# EasyEDA Pro project ProDoc_OHPP_005C_WITH_POWER.epro, board OHPP-005C
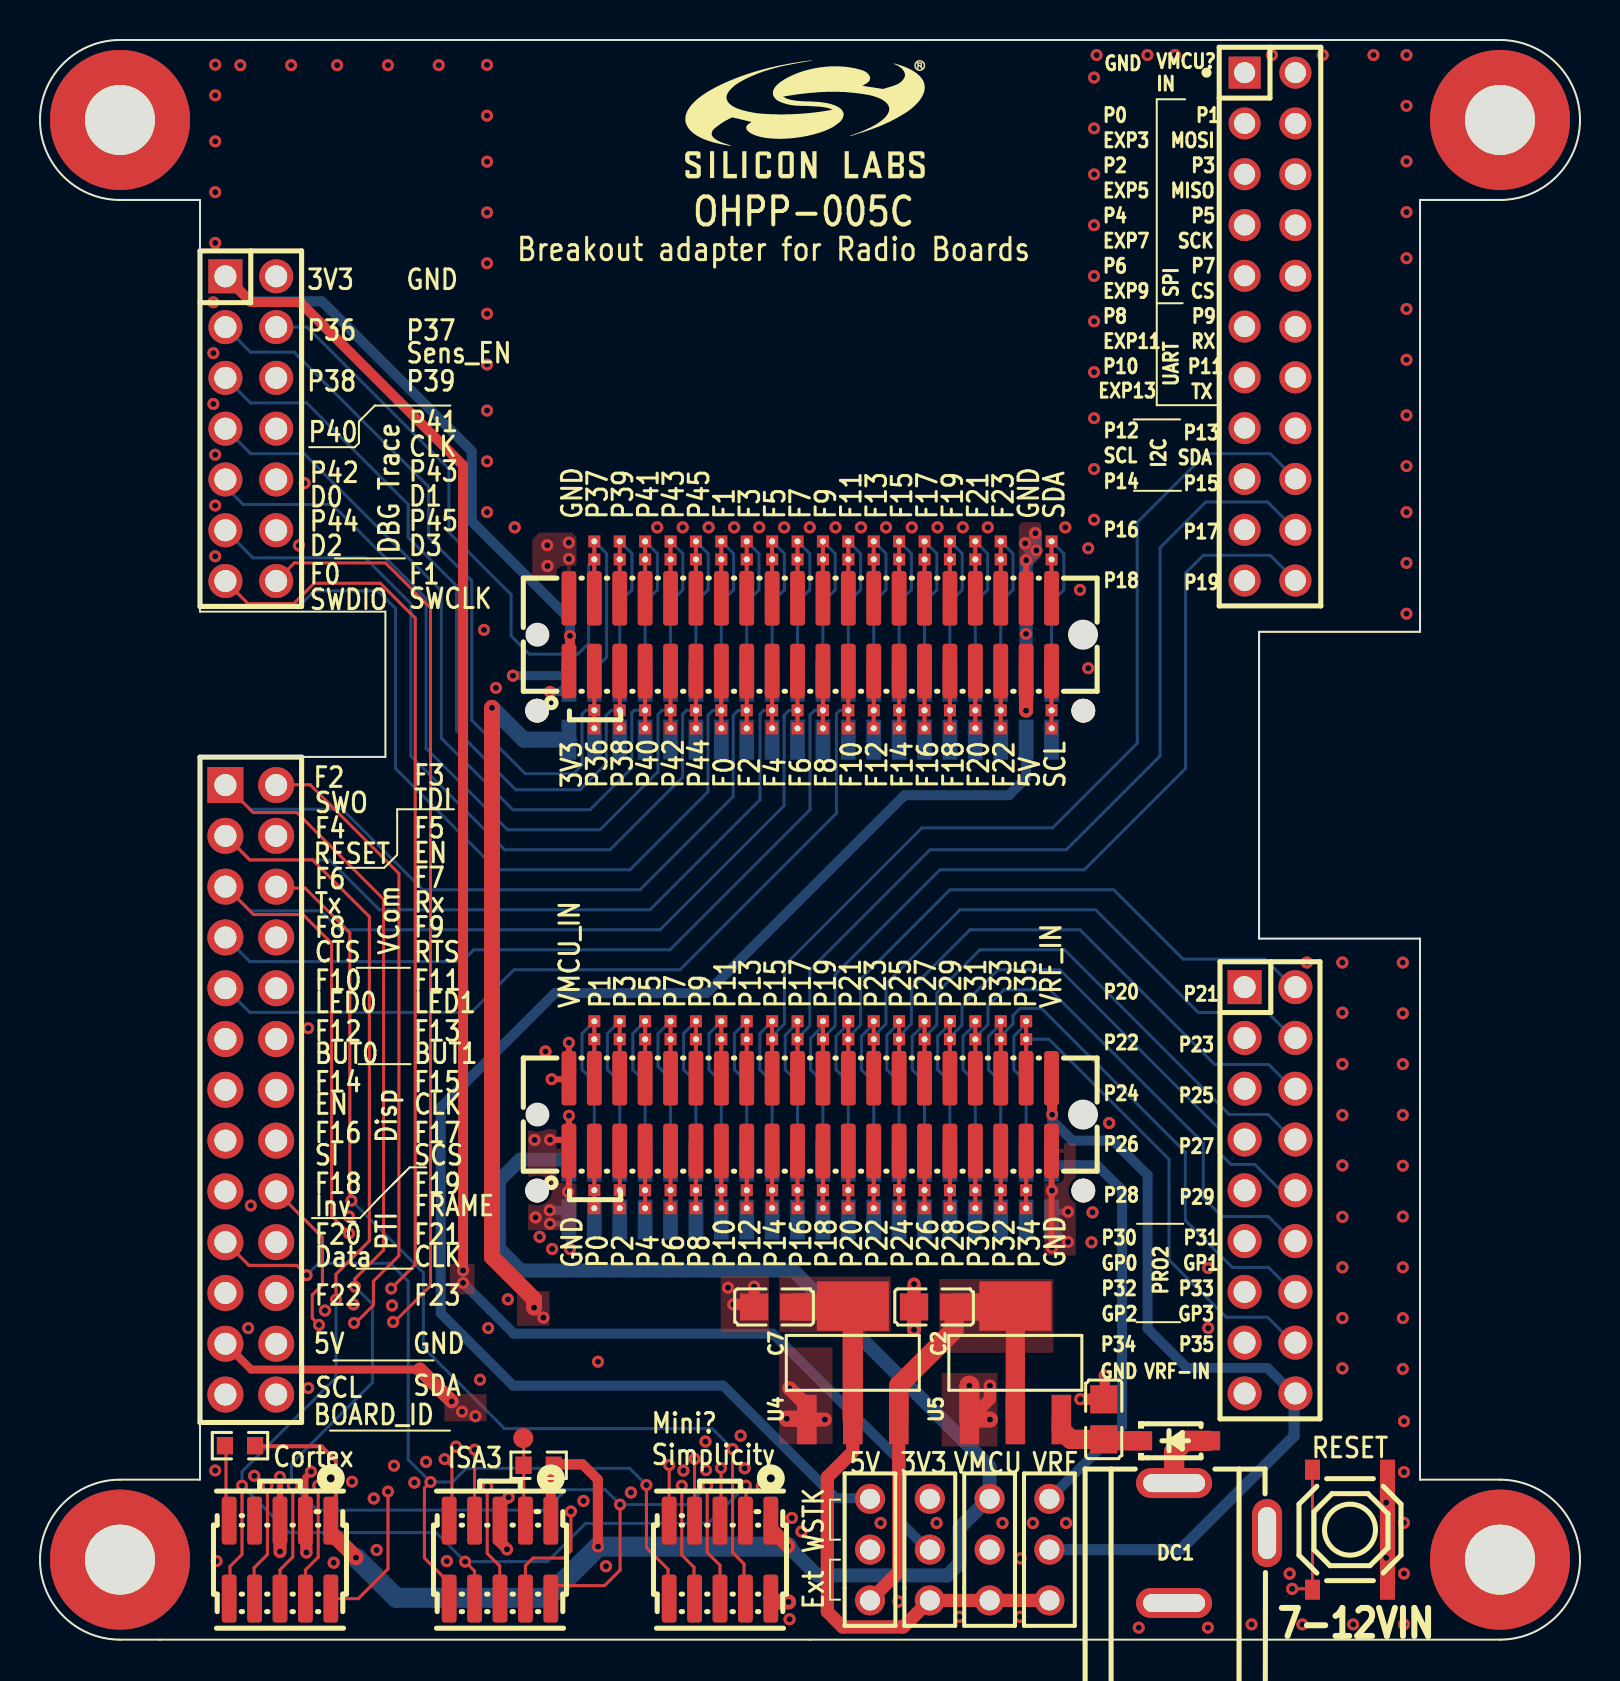
[diagram p3: board, top side]
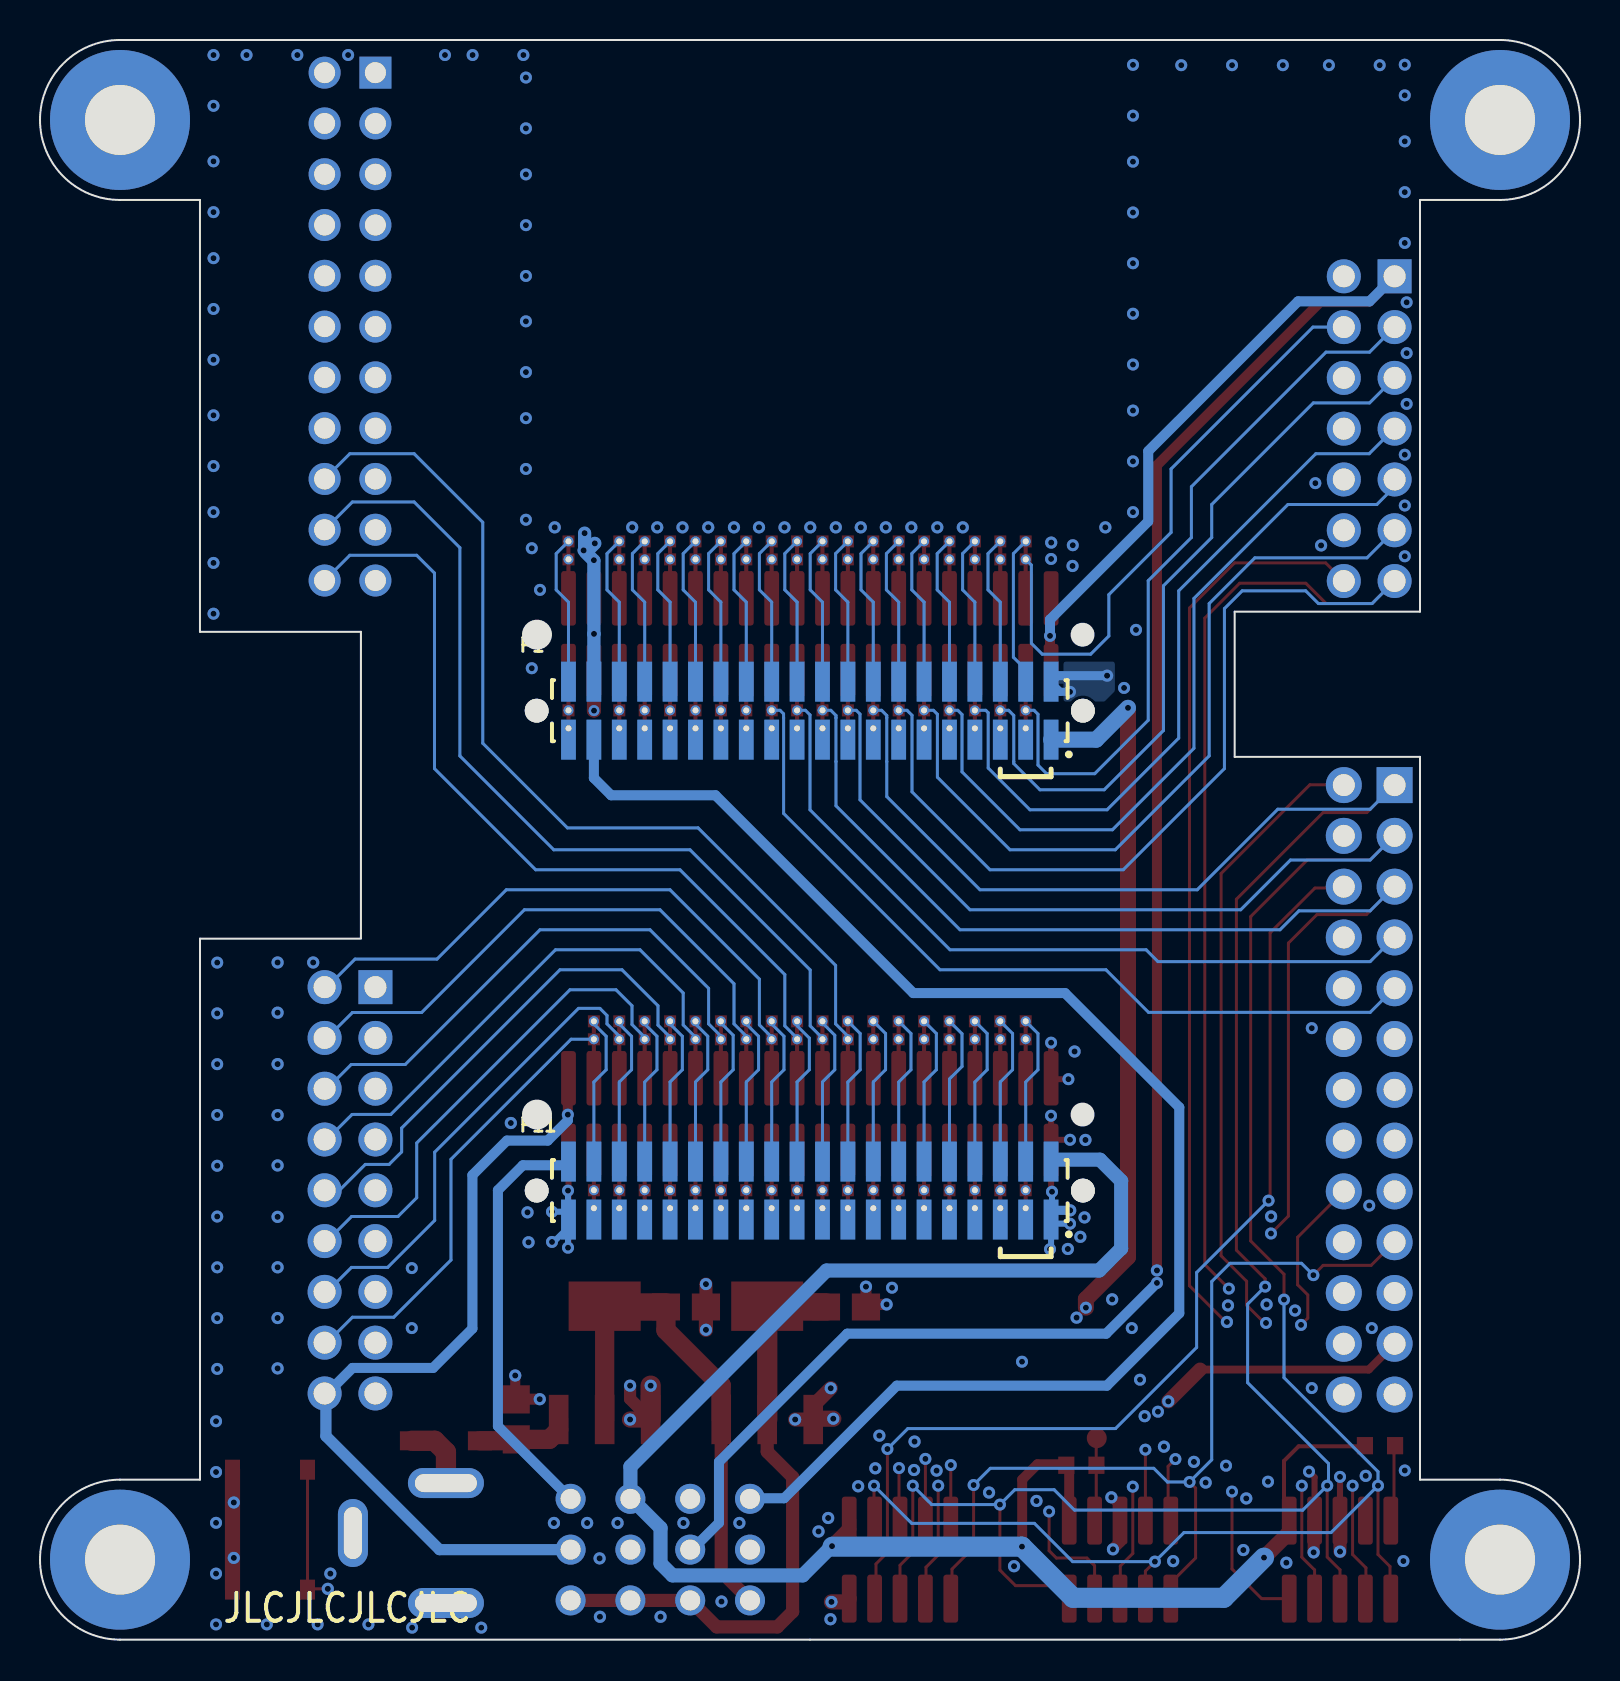
[diagram p4: board, bottom side, seen from below]

Outline 77 x 80 mm; copper layers: Top Layer, GND1, Inner1, Inner2, GND2, Bottom Layer. Coordinates in mm from the lower left corner of the outline.
Outline path: 4,72 arc(0,76) 4,80 73,80 arc(77,76) 73,72 69,72 69,50.4 60.96,50.4 60.96,35.06 69,35.06 69,8 73,8 arc(77,4) 73,0 4,0 arc(0,4) 4,8 8,8 8,44.15 17.27,44.15 17.27,51.41 8,51.41 8,72 4,72
Stack: Top Layer 0.035mm Outer layer thickness 1oz / Dielectric1 0.0994mm 3313 RC57% 4.2mil / GND1 0.0152mm Inner layer thickness / Dielectric2 0.55mm 0.55mm H/H No copper / Inner1 0.0152mm Inner layer thickness / Dielectric3 0.1088mm 2116 RC54% 4.9mil / Inner2 0.0152mm Inner layer thickness / Dielectric4 0.55mm 0.55mm H/H No copper / GND2 0.0152mm Inner layer thickness / Dielectric5 0.0994mm 3313 RC57% 4.2mil / Bottom Layer 0.035mm Outer layer thickness 1oz

## Design rules (mm)
template: Custom Config
spacing copperThickness1oz (default): track to track 0.152, other pairs 0 to 0.3
spacing copperThickness2oz: track to track 0.203, other pairs 0.152 to 0.3
spacing copperThicknessInner0.5oz: track to track 0.089, other pairs 0.152 to 0.3
track width copperThickness1oz (default): min 0.15, default 0.15, max 2.54
track width copperThickness2oz: min 0.203, default 0.254, max 2.54
track width copperThickness0.5oz: min 0.089, default 0.254, max 2.54
differential pair differentialPair (default): width min 0.127, default 0.254, max 2.54; gap min 0.152, default 0.152
via viaSize (default): diameter min 0.3, default 0.61, max 10; hole min 0.2, default 0.305, max 6.3

## Placement (name value [footprint] x y rotation side)
C2  10uF  [C0805]  44.7 16.64 0 top
C3  10uF  [C0805]  53.19 11.02 270 top
C7  10uF  [C0805]  36.7 16.64 0 top
D1  B5819W SL  [SOD-123_L2.7-W1.6-LS3.7-RD-1]  56.71 9.94 0 top
DC1  DC-005-20A  [DC-IN-TH_DC-005-20A]  59.03 4.83 90 top
H3  2.54-1*3  [HDR-TH_3P-P2.54-V-M-1]  47.48 4.5 90 top
H7  2.54-1*3  [HDR-TH_3P-P2.54-V-M-1]  50.47 4.5 90 top
H8  2.54-1*3  [HDR-TH_3P-P2.54-V-M-1]  44.49 4.5 90 top
H9  2.54-1*3  [HDR-TH_3P-P2.54-V-M-1]  41.5 4.5 90 top
H11  -  [HOLE_D3M5_D7M0_PAD_PTH]  4 4 0 top
H12  -  [HOLE_D3M5_D7M0_PAD_PTH]  73 4 0 top
H13  -  [HOLE_D3M5_D7M0_PAD_PTH]  4 76 0 top
H14  -  [HOLE_D3M5_D7M0_PAD_PTH]  73 76 0 top
H15  X6521WV-2x09H-C60D30  [HDR-TH_18P-P2.54-V-M-R2-C9-S2.54]  61.5 22.47 270 top
H16  X6521WV-2x11H-C60D30  [HDR-TH_22P-2.54-V-M-R2-C11-S2.54]  61.5 65.67 270 top
H17  X6521WV-2x13H-C60D30  [HDR-TH_26P-P2.54-V-M-R2-C13-S2.54]  10.54 27.5 270 top
H18  X6521WV-2x07H-C60D30  [HDR-TH_14P-P2.54-V-M-R2-C7-S2.54]  10.54 60.56 270 top
P1  *  [SAMTEC_SFC-120-T2-F-D-LC_1]  38.51 46.46 180 bottom
P3  3131-40MG0BK00T2  [CONN-SMD_40P-P1.27_WCON_3131-40MG0BK00T2_1]  38.51 50.26 180 top
P4  3131-40MG0BK00T2  [CONN-SMD_40P-P1.27_WCON_3131-40MG0BK00T2_1]  38.51 26.26 180 top
P5  -  [JUMPER_RECT_3PIN_NSNS]  27.72 22.47 90 top
P6  23bddce16d364f51bbc85156d37ba6bb  [IDC-SMD_3132-10MG0BK00R2_1]  34 4 180 top
P9  23bddce16d364f51bbc85156d37ba6bb  [IDC-SMD_3132-10MG0BK00R2_1]  12 4 180 top
P10  23bddce16d364f51bbc85156d37ba6bb  [IDC-SMD_3132-10MG0BK00R2_1]  23 4 180 top
P11  *  [SAMTEC_SFC-120-T2-F-D-LC_1]  38.51 22.46 180 bottom
P13  -  [JUMPER_RECT_3PIN_NSNS]  27.72 30.02 270 top
P14  -  [JUMPER_RECT_3PIN_NSNS]  28.99 22.47 90 top
P15  -  [JUMPER_RECT_3PIN_NSNS]  28.99 30.02 270 top
P16  -  [JUMPER_RECT_3PIN_NSNS]  30.26 22.47 90 top
P17  -  [JUMPER_RECT_3PIN_NSNS]  30.26 30.02 270 top
P18  -  [JUMPER_RECT_3PIN_NSNS]  31.53 22.47 90 top
P19  -  [JUMPER_RECT_3PIN_NSNS]  31.53 30.02 270 top
P20  -  [JUMPER_RECT_3PIN_NSNS]  32.8 22.47 90 top
P21  -  [JUMPER_RECT_3PIN_NSNS]  32.8 30.02 270 top
P22  -  [JUMPER_RECT_3PIN_NSNS]  34.07 22.47 90 top
P23  -  [JUMPER_RECT_3PIN_NSNS]  34.07 30.02 270 top
P24  -  [JUMPER_RECT_3PIN_NSNS]  35.34 22.47 90 top
P25  -  [JUMPER_RECT_3PIN_NSNS]  35.34 30.02 270 top
P26  -  [JUMPER_RECT_3PIN_NSNS]  36.61 22.47 90 top
P27  -  [JUMPER_RECT_3PIN_NSNS]  36.61 30.02 270 top
P28  -  [JUMPER_RECT_3PIN_NSNS]  37.88 22.47 90 top
P29  -  [JUMPER_RECT_3PIN_NSNS]  37.88 30.02 270 top
P30  -  [JUMPER_RECT_3PIN_NSNS]  39.15 22.47 90 top
P31  -  [JUMPER_RECT_3PIN_NSNS]  39.15 30.02 270 top
P32  -  [JUMPER_RECT_3PIN_NSNS]  40.42 22.47 90 top
P33  -  [JUMPER_RECT_3PIN_NSNS]  40.42 30.02 270 top
P34  -  [JUMPER_RECT_3PIN_NSNS]  41.69 22.47 90 top
P35  -  [JUMPER_RECT_3PIN_NSNS]  41.69 30.02 270 top
P36  -  [JUMPER_RECT_3PIN_NSNS]  42.96 22.47 90 top
P37  -  [JUMPER_RECT_3PIN_NSNS]  42.96 30.02 270 top
P38  -  [JUMPER_RECT_3PIN_NSNS]  44.23 22.47 90 top
P39  -  [JUMPER_RECT_3PIN_NSNS]  44.23 30.02 270 top
P40  -  [JUMPER_RECT_3PIN_NSNS]  45.5 22.47 90 top
P41  -  [JUMPER_RECT_3PIN_NSNS]  45.5 30.02 270 top
P42  -  [JUMPER_RECT_3PIN_NSNS]  46.77 22.47 90 top
P43  -  [JUMPER_RECT_3PIN_NSNS]  46.77 30.02 270 top
P44  -  [JUMPER_RECT_3PIN_NSNS]  48.04 22.47 90 top
P45  -  [JUMPER_RECT_3PIN_NSNS]  48.04 30.02 270 top
P46  -  [JUMPER_RECT_3PIN_NSNS]  49.31 22.47 90 top
P47  -  [JUMPER_RECT_3PIN_NSNS]  49.31 30.02 270 top
P48  -  [JUMPER_RECT_3PIN_NSNS]  27.72 46.47 90 top
P49  -  [JUMPER_RECT_3PIN_NSNS]  27.72 54.02 270 top
P50  -  [JUMPER_RECT_3PIN_NSNS]  28.99 46.47 90 top
P51  -  [JUMPER_RECT_3PIN_NSNS]  28.99 54.02 270 top
P52  -  [JUMPER_RECT_3PIN_NSNS]  30.26 46.47 90 top
P53  -  [JUMPER_RECT_3PIN_NSNS]  30.26 54.02 270 top
P54  -  [JUMPER_RECT_3PIN_NSNS]  31.53 46.47 90 top
P55  -  [JUMPER_RECT_3PIN_NSNS]  31.53 54.02 270 top
P56  -  [JUMPER_RECT_3PIN_NSNS]  32.8 46.47 90 top
P57  -  [JUMPER_RECT_3PIN_NSNS]  32.8 54.02 270 top
P58  -  [JUMPER_RECT_3PIN_NSNS]  34.07 46.47 90 top
P59  -  [JUMPER_RECT_3PIN_NSNS]  34.07 54.02 270 top
P60  -  [JUMPER_RECT_3PIN_NSNS]  35.34 46.47 90 top
P61  -  [JUMPER_RECT_3PIN_NSNS]  35.34 54.02 270 top
P62  -  [JUMPER_RECT_3PIN_NSNS]  36.61 46.47 90 top
P63  -  [JUMPER_RECT_3PIN_NSNS]  37.88 54.02 270 top
P64  -  [JUMPER_RECT_3PIN_NSNS]  36.61 54.02 270 top
P65  -  [JUMPER_RECT_3PIN_NSNS]  37.88 46.47 90 top
P66  -  [JUMPER_RECT_3PIN_NSNS]  39.15 46.47 90 top
P67  -  [JUMPER_RECT_3PIN_NSNS]  39.15 54.02 270 top
P68  -  [JUMPER_RECT_3PIN_NSNS]  40.42 46.47 90 top
P69  -  [JUMPER_RECT_3PIN_NSNS]  40.42 54.02 270 top
P70  -  [JUMPER_RECT_3PIN_NSNS]  41.69 46.47 90 top
P71  -  [JUMPER_RECT_3PIN_NSNS]  41.69 54.02 270 top
P72  -  [JUMPER_RECT_3PIN_NSNS]  42.96 46.47 90 top
P73  -  [JUMPER_RECT_3PIN_NSNS]  42.96 54.02 270 top
P74  -  [JUMPER_RECT_3PIN_NSNS]  44.23 46.47 90 top
P75  -  [JUMPER_RECT_3PIN_NSNS]  44.23 54.02 270 top
P76  -  [JUMPER_RECT_3PIN_NSNS]  45.5 46.47 90 top
P77  -  [JUMPER_RECT_3PIN_NSNS]  45.5 54.02 270 top
P78  -  [JUMPER_RECT_3PIN_NSNS]  46.77 46.47 90 top
P79  -  [JUMPER_RECT_3PIN_NSNS]  46.77 54.02 270 top
P80  -  [JUMPER_RECT_3PIN_NSNS]  48.04 46.47 90 top
P81  -  [JUMPER_RECT_3PIN_NSNS]  48.04 54.02 270 top
P82  -  [JUMPER_RECT_3PIN_NSNS]  50.58 54.02 270 top
P83  -  [JUMPER_RECT_3PIN_NSNS]  50.58 46.47 90 top
R1  100kΩ  [R0603]  10 9.7 0 top
R2  100kΩ  [R0603]  24.93 8.72 0 top
SW2  TS-1187A-B-A-B  [SW-SMD_4P-L5.1-W5.1-P3.70-LS6.5-TL_H1.5]  65.5 5.5 90 top
TP1  -  [Test-Point-0.5mm]  24.16 10.08 0 top
U4  TLV76133DCYR  [SOT-223-4_L6.5-W3.5-P2.30-LS7.0-TR]  40.64 13.84 0 top
U5  TLV76150DCYR  [SOT-223-4_L6.5-W3.5-P2.30-LS7.0-BL]  48.77 13.84 0 top

## Footprints (pads in the part's own frame, mm; a bottom-side part is the same pattern mirrored in y, then rotated)
C0805
  rect 1.41x1.35 smd: 1(-1,0) 2(1,0)
CONN-SMD_40P-P1.27_WCON_3131-40MG0BK00T2_1
  rrect 0.74x2.72 smd: 1(12.065,1.815) 2(12.065,-1.815) 3(10.795,1.815) 4(10.795,-1.815) 5(9.525,1.815) 6(9.525,-1.815) 7(8.255,1.815) 8(8.255,-1.815) 9(6.985,1.815) 10(6.985,-1.815) 11(5.715,1.815) 12(5.715,-1.815) 13(4.445,1.815) 14(4.445,-1.815) 15(3.175,1.815) 16(3.175,-1.815) 17(1.905,1.815) 18(1.905,-1.815) 19(0.635,1.815) 20(0.635,-1.815) 21(-0.635,1.815) 22(-0.635,-1.815) 23(-1.905,1.815) 24(-1.905,-1.815) 25(-3.175,1.815) 26(-3.175,-1.815) 27(-4.445,1.815) 28(-4.445,-1.815) 29(-5.715,1.815) 30(-5.715,-1.815) 31(-6.985,1.815) 32(-6.985,-1.815) 33(-8.255,1.815) 34(-8.255,-1.815) 35(-9.525,1.815) 36(-9.525,-1.815) 37(-10.795,1.815) 38(-10.795,-1.815) 39(-12.065,1.815) 40(-12.065,-1.815)
DC-IN-TH_DC-005-20A
  oval 1.5x3.8 hole 0.9x3.1: 1(3,2.325) 2(-3,2.325)
  oval 3.4x1.5 hole 2.6x0.9: 3(0.5,-2.325)
HDR-TH_3P-P2.54-V-M-1
  round 1.5 hole 1: 1(-2.54,0) 2(0,0) 3(2.54,0)
HDR-TH_14P-P2.54-V-M-R2-C7-S2.54
  rect 1.7x1.7 hole 1.1: 1(-7.62,-1.27)
  round 1.7 hole 1.1: 2(-7.62,1.27) 3(-5.08,-1.27) 4(-5.08,1.27) 5(-2.54,-1.27) 6(-2.54,1.27) 7(0,-1.27) 8(0,1.27) 9(2.54,-1.27) 10(2.54,1.27) 11(5.08,-1.27) 12(5.08,1.27) 13(7.62,-1.27) 14(7.62,1.27)
HDR-TH_18P-P2.54-V-M-R2-C9-S2.54
  rect 1.7x1.7 hole 1.1: 1(-10.16,-1.27)
  round 1.7 hole 1.1: 2(-10.16,1.27) 3(-7.62,-1.27) 4(-7.62,1.27) 5(-5.08,-1.27) 6(-5.08,1.27) 7(-2.54,-1.27) 8(-2.54,1.27) 9(0,-1.27) 10(0,1.27) 11(2.54,-1.27) 12(2.54,1.27) 13(5.08,-1.27) 14(5.08,1.27) 15(7.62,-1.27) 16(7.62,1.27) 17(10.16,-1.27) 18(10.16,1.27)
HDR-TH_22P-2.54-V-M-R2-C11-S2.54
  rect 1.6x1.6 hole 1.05: 1(-12.7,-1.27)
  round 1.6 hole 1.05: 2(-12.7,1.27) 3(-10.16,-1.27) 4(-10.16,1.27) 5(-7.62,-1.27) 6(-7.62,1.27) 7(-5.08,-1.27) 8(-5.08,1.27) 9(-2.54,-1.27) 10(-2.54,1.27) 11(0,-1.27) 12(0,1.27) 13(2.54,-1.27) 14(2.54,1.27) 15(5.08,-1.27) 16(5.08,1.27) 17(7.62,-1.27) 18(7.62,1.27) 19(10.16,-1.27) 20(10.16,1.27) 21(12.7,-1.27) 22(12.7,1.27)
HDR-TH_26P-P2.54-V-M-R2-C13-S2.54
  rect 1.8x1.8 hole 1.1: 1(-15.24,-1.27)
  round 1.8 hole 1.1: 2(-15.24,1.27) 3(-12.7,-1.27) 4(-12.7,1.27) 5(-10.16,-1.27) 6(-10.16,1.27) 7(-7.62,-1.27) 8(-7.62,1.27) 9(-5.08,-1.27) 10(-5.08,1.27) 11(-2.54,-1.27) 12(-2.54,1.27) 13(0,-1.27) 14(0,1.27) 15(2.54,-1.27) 16(2.54,1.27) 17(5.08,-1.27) 18(5.08,1.27) 19(7.62,-1.27) 20(7.62,1.27) 21(10.16,-1.27) 22(10.16,1.27) 23(12.7,-1.27) 24(12.7,1.27) 25(15.24,-1.27) 26(15.24,1.27)
HOLE_D3M5_D7M0_PAD_PTH
  round 7 hole 3.5: 1(0,0)
IDC-SMD_3132-10MG0BK00R2_1
  rrect 0.74x2.4 smd: 1(-2.54,-1.95) 2(-2.54,1.95) 3(-1.27,-1.95) 4(-1.27,1.95) 5(0,-1.95) 6(0,1.95) 7(1.27,-1.95) 8(1.27,1.95) 9(2.54,-1.95) 10(2.54,1.95)
JUMPER_RECT_3PIN_NSNS
  round 0.5 hole 0.3: 1(-0.9,0) 2(0,0)
  rect 0.6x0.6 smd: 1(-0.9,0) 2(0,0) 3(0.9,0)
R0603
  rect 0.806x0.864 smd: 1(-0.753,0) 2(0.753,0)
SAMTEC_SFC-120-T2-F-D-LC_1
  round 1.19 hole 1.19: (-13.655,0) (13.655,0)
  rect 0.74x2 smd: 01(12.065,-1.45) 02(12.065,1.45) 03(10.795,-1.45) 04(10.795,1.45) 05(9.525,-1.45) 06(9.525,1.45) 07(8.255,-1.45) 08(8.255,1.45) 09(6.985,-1.45) 10(6.985,1.45) 11(5.715,-1.45) 12(5.715,1.45) 13(4.445,-1.45) 14(4.445,1.45) 15(3.175,-1.45) 16(3.175,1.45) 17(1.905,-1.45) 18(1.905,1.45) 19(0.635,-1.45) 20(0.635,1.45) 21(-0.635,-1.45) 22(-0.635,1.45) 23(-1.905,-1.45) 24(-1.905,1.45) 25(-3.175,-1.45) 26(-3.175,1.45) 27(-4.445,-1.45) 28(-4.445,1.45) 29(-5.715,-1.45) 30(-5.715,1.45) 31(-6.985,-1.45) 32(-6.985,1.45) 33(-8.255,-1.45) 34(-8.255,1.45) 35(-9.525,-1.45) 36(-9.525,1.45) 37(-10.795,-1.45) 38(-10.795,1.45) 39(-12.065,-1.45) 40(-12.065,1.45)
SOD-123_L2.7-W1.6-LS3.7-RD-1
  rect 1.2x0.95 smd: 1(-1.7,0) 2(1.7,0)
SOT-223-4_L6.5-W3.5-P2.30-LS7.0-BL
  rect 0.98x2.47 smd: 1(-2.3,-2.835) 2(0,-2.835) 3(2.3,-2.835)
  rect 3.6x2.47 smd: 4(0,2.835)
SOT-223-4_L6.5-W3.5-P2.30-LS7.0-TR
  rect 0.98x2.47 smd: 1(-2.3,-2.835) 2(0,-2.835) 3(2.3,-2.835)
  rect 3.6x2.47 smd: 4(0,2.835)
SW-SMD_4P-L5.1-W5.1-P3.70-LS6.5-TL_H1.5
  rect 1x0.75 smd: 1(-3,1.875) 2(3,1.875) 3(-3,-1.875) 4(3,-1.875)
Test-Point-0.5mm
  round 1 smd: 1(0,0)

## Nets
As in the schematic.

Pads without a net: P9 7

## Via types
v1: diameter 0.6, hole 0.3, Top Layer to Bottom Layer, 148 vias
v2: diameter 0.61, hole 0.305, Top Layer to Bottom Layer, 95 vias
v3: diameter 0.61, hole 0.3, Top Layer to Bottom Layer, 7 vias
v4: diameter 0.55, hole 0.3, Top Layer to Bottom Layer, 1 via

## Routing (per net, layer and track width the routed paths; a pad name or vN(x,y) marks a point on that pad's centre or on a via; arc(x,y) is an arc through that point)
+3V3: length 61.6
  Top Layer w0.8: v1(24.71,16.6) 24.71,17.03 22.6,19.13 22.6,46.6
  GND1 w0.607: v1(24.71,16.6) 25.17,16.14 v2(25.17,16.1)
  Inner1 w0.8: v1(24.71,16.6) 25.56,15.75 38.61,15.75 44.58,9.78 44.58,7.22 44.39,7.04
  Bottom Layer w0.8: 22.6,46.6 24.19,45.01 26.45,45.01
  vias: v1(22.6,46.6)
+5V: length 73.4
  Bottom Layer w0.5: 41.33,7.07 39.79,7.07 34.16,12.7 23.66,12.7 20.04,16.32 20.04,26.62 25.75,32.33 33.33,32.33 43.23,42.23 48.44,42.23 49.31,43.09 49.31,45.01
+12V: length 4.7
  Top Layer w0.963: D1.1 53.26,9.94 C3.2 51.53,10.02 51.07,10.48 U5.3
GND: length 66.7
  Top Layer w0.15: P6.2 36.54,2.74
  Top Layer w0.3: P4.39 50.58,19.63 v1(50.6,19.6) ; 26.4,22.4 26.45,22.45 P4.1 ; P3.38 v1(49.31,53.99) ; 26.45,51.77 P3.2 ; v1(25.5,25) 26.39,25 26.45,25.06 26.45,26.2 v1(26.45,26.2)
  Top Layer w0.305: v1(13.55,8.4) 13.27,8.12 P9.3 ; P9.5 v1(12,8.14)
  Top Layer w0.455: 23.45,7.14 23,6.69 P10.5
  Top Layer w0.505: v2(53.24,13.21) 53.24,12.03
  Top Layer w0.556: 53.24,12.03 v2(52.01,12.03) ; v2(35.7,17.65) C7.1 35.57,16.76 v2(34.67,16.76) ; P10.5 23,4.89 23.35,4.54
  Top Layer w0.607: v2(13.32,4.36) 13.32,5.9 P9.3 ; v2(47.5,12.7) 47.5,12.04 46.47,11.01
  Top Layer w0.658: C2.1 v2(43.7,17.78) ; v2(12,4.4) P9.5
  Top Layer w0.709: v2(39.24,11.01) U4.1 38.34,11.7 v2(37.46,12.57) ; C2.1 v2(43.7,15.49)
  Top Layer w0.759: P6.2 36.7,1.89 v2(37.43,1.89) ; SW2.4 SW2.3
  Top Layer w0.81: v2(37.34,11.05) 38.3,11.05 U4.1 ; 46.47,11.01 v2(47.5,11.01)
  Top Layer w1.014: 46.47,11.01 v2(46.47,12.7)
  Bottom Layer w0.3: 50.7,21.4 51.4,21.4 ; v1(26.5,19.53) 26.45,19.58 P11.01 26.24,20.8 25.5,20.8 ; v1(51.4,19.89) 51.31,19.89 50.7,20.5 ; 26.4,21.47 26.4,22.4 ; v1(50.6,19.6) 50.6,22.5
  Bottom Layer w0.404: P1.02 26.45,47.84 26,47.4 v1(25.5,47.4)
  Bottom Layer w0.455: v2(25.49,21.47) 26.4,21.47 26.4,21.05 P11.01 ; v2(23.65,48.21) 26.15,48.21 P1.02
  Bottom Layer w0.658: 49.72,54.37 49.31,53.96 49.31,50.29 ; 49.31,50.29 v1(49.3,50.3) ; 49.31,50.29 P1.38 ; v2(49.77,55.34) 49.77,54.71 49.57,54.51 v2(49.26,54.83)
  vias: v1(8.67,66.88) v1(8.67,64.34) v1(8.67,61.8) v1(8.76,78.76) v1(8.76,77.23) v1(8.76,74.93) v1(8.76,72.39) v1(8.76,69.85) v1(8.76,59.26) v1(8.76,56.72) v1(8.76,54.18) v1(8.76,8.46) v1(8.83,3.93) v1(10.02,78.74) v1(10.41,15.58) v1(10.54,21.71) v1(12.56,78.74) v1(13.23,57.84) v1(13.41,30.58) v1(13.41,12.58) v1(14.86,78.74) v1(15.6,7.9) v1(17.4,78.74) v1(17.7,8.7) v1(19.94,78.74) v1(22,13) v1(22.2,50.5) v1(22.35,78.76) v1(22.35,76.22) v1(22.35,73.91) v1(22.35,71.37) v1(22.35,68.83) v1(22.35,66.31) v1(22.35,63.77) v1(22.35,61.47) v1(22.35,58.93) v1(22.35,56.39) v1(22.41,15.58) v1(22.8,47.6) v1(25.36,54.73) v1(25.5,20.8) v1(26.45,54.05) v1(26.4,22.4) v1(27.9,13.9) v1(34.4,17.6) v1(50.6,22.46) v1(51.4,21.4) v1(52,52.5) v1(52.41,54.58) v1(52.41,48.58) v1(52.7,78.12) v1(52.7,75.58) v1(52.7,73.28) v1(52.7,70.74) v1(52.7,68.2) v1(52.7,65.93) v1(52.7,63.39) v1(52.7,61.09) v1(52.7,58.55) v1(52.7,56.01) v1(52.83,79.25) v1(54.94,0.6) v1(55.37,79.25) v1(56.75,79.25) v1(58.41,18.58) v1(58.41,15.58) v1(58.4,0.6) v1(60.58,0.76) v1(61.59,79.25) v1(63.12,0.76) v1(64.13,79.25) v1(65.66,0.76) v1(66.67,79.25) v1(68.14,33.86) v1(68.14,31.32) v1(68.14,28.78) v1(68.14,26.24) v1(68.14,23.7) v1(68.14,21.16) v1(68.14,18.62) v1(68.14,16.08) v1(68.14,13.54) v1(68.2,10.92) v1(68.2,8.38) v1(68.2,5.84) v1(68.2,3.3) v1(68.2,0.76) v1(68.32,79.25) v1(68.32,76.71) v1(68.32,73.93) v1(68.32,71.39) v1(68.32,69.09) v1(68.32,66.55) v1(68.32,64.01) v1(68.32,61.23) v1(68.32,58.69) v1(68.32,56.39) v1(68.32,53.85) v1(68.32,51.31) v2(10.71,8.19) v2(12.95,54.72) v2(14.25,16.46) v2(14.68,3.85) v2(15.67,16.76) v2(16.69,7.06) v2(16.83,4.48) v2(17.6,16.71) v2(19.3,8.89) v2(20.8,9.65) v2(23.39,17.02) v2(23.43,7.12) v2(23.35,4.52) v2(23.73,55.63) v2(24.73,24.99) v2(24.78,21.12) v2(24.98,20.15) v2(25.27,29.41) v2(25.37,53.7) v2(25.61,19.54) v2(26.44,54.86) v2(27.18,6.94) v2(28.3,3.67) v2(30.86,55.63) v2(32.13,55.63) v2(32.17,8.45) v2(33.27,9.91) v2(33.3,8.48) v2(33.43,55.63) v2(34.71,55.63) v2(35.03,10.2) v2(35.96,55.63) v2(36.09,7.67) v2(37.21,55.63) v2(37.48,1.02) v2(37.59,6.08) v2(38.07,5.41) v2(38.49,55.63) v2(39.77,55.63) v2(41.05,55.63) v2(42.03,5.83) v2(42.3,55.63) v2(42.93,1.91) v2(43.59,55.63) v2(44.83,5.83) v2(44.88,55.63) v2(45.97,1.14) v2(46.14,55.63) v2(47.39,55.63) v2(48.12,5.83) v2(49.02,4.06) v2(49,1.14) v2(49.64,5.83) v2(49.82,54.47) v2(51.26,55.63) v2(51.3,5.83) v2(52.63,21.37) v2(52.57,19.87) v2(62.48,3.3) v2(63.34,33.86) v2(65.12,33.86) v2(65.12,31.35) v2(65.12,28.78) v2(65.12,26.23) v2(65.12,23.72) v2(65.12,21.14) v2(65.12,18.62) v2(65.12,16.08) v2(65.12,13.57) v2(67.31,6.86) v2(67.31,4.09) v3(15.45,21.17) v3(18.72,7.85) v3(20.34,3.93) v3(29.55,7.36) v3(35.23,8.57) v3(53.46,25.84)
+EXT_3V3: length 30.7
  Top Layer w0.658: H7.1 H3.1 H8.1 43.16,0.63 40.13,0.63 39.37,1.4 39.37,8.13 40.64,9.4 U4.2
  Top Layer w1.014: U4.2 U4.4
  Top Layer w1.369: U4.4 40.6,16.64 C7.2
+EXT_5V: length 25.2
  Top Layer w0.658: U4.3 42.94,3.4 H9.1
  Top Layer w0.963: U4.3 42.94,12.71 45.7,15.48 C2.2 ; U5.2 U5.4
  Top Layer w1.369: U5.4 48.73,16.64 C2.2
+R_3V3: length 116.2
  Top Layer w0.5: H18.1 10.56,66.89 12.99,66.89 21.15,58.73 v2(21.15,18.46) ; P3.1 26.5,48.5 26.5,50.2
  GND1 w0.658: v2(21.15,18.46) v1(21.15,17.84)
  Bottom Layer w0.5: v1(21.15,17.84) 23.69,15.3 36.64,15.3 43.05,8.89 43.05,5.84 44.39,4.5 ; H18.1 10.52,66.93 14.1,66.93 21.59,59.44 21.59,55.92 26.5,51.01 26.5,50.2
  vias: v1(26.5,50.2)
+R_5V: length 94.1
  Top Layer w0.395: H17.23 10.56,13.51 18.99,13.51
  Top Layer w0.7: P3.37 49.31,46.47 v4(49.3,46.46) ; v2(20.59,11.92) 18.99,13.51
  GND1 w0.709: v2(21.77,11.18) 21.33,11.18 v1(21.1,11.4) v2(20.59,11.92)
  Inner1 w0.7: 41.33,4.53 39.62,6.24 39.62,7.24 35.31,11.56 21.92,11.56 21.77,11.4 ; v4(49.3,46.46) 49.3,45.47 50.28,44.49 50.28,43.04 45.18,37.94 32.48,37.94 22.35,27.81 22.35,17.67 21.1,16.42 v1(21.1,11.4)
+R_VMCU_IN: length 121.9
  Top Layer w0.3: 26.45,27.77 26.19,28.03 v1(25.58,28.03) ; P4.2 26.45,29.86
  Inner2 w0.594: 58.87,77.08 61.48,77.08 H16.2
  Inner2 w1: H3.2 45.97,6.01 45.97,10.02 40.5,15.49 27.59,15.49 22.99,20.09 22.99,26.93 24.09,28.03 v1(25.58,28.03) 26.45,28.9 v1(26.45,29.85) 26.45,32.87 32.57,39 46.8,39 53.7,45.9 53.7,72.62 58.15,77.08 58.87,77.08
+R_VRF_IN: length 41.1
  Top Layer w0.5: v1(50.61,26.26) 50.61,28.04 P4.40
  Bottom Layer w0.5: v1(50.61,26.26) 50.61,25.96 51.61,24.96 53.65,24.96 55.38,23.23 55.38,15.56 57.35,13.59 61.37,13.59 62.69,12.27
  Bottom Layer w0.556: 62.69,12.27 62.71,12.26 62.71,10.18 57.03,4.5 H7.2
+VMCU_DEBUG: length 94.4
  Top Layer w0.2: 10.7,9.7 10.73,9.67 14.07,9.67 14.8,8.94 14.8,6.21 P9.1
  Top Layer w0.5: 25.54,8.51 P10.1 ; v1(27.9,4.65) 27.89,4.66 27.89,8.01 27.12,8.77 26.03,8.77 ; P9.1 14.54,5.36
  Top Layer w0.709: v1(37.4,4.68) 36.54,5.54 P6.1
  Top Layer w0.762: 14.54,5.36 15.8,4.1
  Bottom Layer w0.7: P11.02 26.35,24 24,24 22.94,22.94 22.94,19.56 24.04,18.46 37.67,18.46 47.48,8.65 H3.3 47.43,7.04 45.97,5.59 45.97,3.81 45.38,3.21 38.86,3.21 v1(37.4,4.68)
  Bottom Layer w1: 15.8,4.1 17.81,2.09 25.34,2.09 v1(27.9,4.65) 37.37,4.65
  vias: v1(15.8,4.1)
+VRF_IN: length 21.1
  Bottom Layer w0.5: H7.3 54.1,10.68 54.1,22.48 52.86,23.72 50.76,23.72 P11.40
BOARD_ID_SDA: length 7.5
  Bottom Layer w0.15: P1.40 50.58,51.89 51.19,52.5 51.19,54.31 P82.1
CORTEX_NRESET: length 151.2
  Top Layer w0.15: v1(35.3,7.7) 35.3,5.98 P6.3 ; 9.5,2.9 9.5,3.66 10.1,4.26 10.1,7.7 ; v1(14.8,17.01) 14.8,18.28 16.47,19.94 16.47,36.16 13.63,39 10.48,39 9.27,40.21 ; v2(62.61,2.54) 63.59,2.54 SW2.1 SW2.2 63.56,8.57 ; P10.8 21.73,3.43 v1(21.25,3.9)
  Inner1 w0.15: v2(62.61,2.54) 60.34,2.54 58.9,3.98 53.75,3.98 52.94,3.17 37.59,3.17 35.3,5.47 v1(35.3,7.7)
  Bottom Layer w0.15: 35.3,7.7 33.41,5.81 27.28,5.81 25.37,3.9 v1(21.25,3.9) 19.8,5.35 12.45,5.35 10.1,7.7 10.1,8.4 14.8,13.1 v1(14.8,17.01) ; 9.27,40.21 10.49,38.99 14.48,38.99 16.96,36.5 30.5,36.5 36,42 36,46.29 36.19,46.48 36.61,46.48
  vias: v1(10.1,7.7)
CORTEX_SWCLK_TCK: length 117.1
  Top Layer w0.15: 32.09,7.7 32.09,4.23 32.7,3.62 32.7,2.9 ; v3(17.66,15.89) 17.72,15.89 19.53,17.7 19.53,51.59 17.27,53.85 12.72,53.85 H18.14 ; 13.91,7.7 13.91,4.12 13.27,3.48 P9.4 ; v1(22.36,7.65) 22.36,4.31 22.99,3.68 22.99,2.07 P10.6
  Inner1 w0.15: v3(17.66,15.89) 17.66,11.45 v1(13.91,7.7) 15.34,6.27 20.98,6.27 v1(22.36,7.65) 27.48,7.65 28.04,7.09 28.04,6.43 28.55,5.92 30.31,5.92 v1(32.09,7.7)
  Inner2 w0.15: H18.14 11.95,53.09 17.65,53.09 18.92,51.82 31.86,51.82 P59.2
CORTEX_SWDIO_TMS: length 128.8
  Top Layer w0.15: v1(17.56,17.56) 18.76,18.76 18.76,51.09 17.02,52.83 13.71,52.83 12.69,51.82 10.4,51.82 H18.13 ; v1(17.4,7.41) 17.4,3.53 15.92,2.05 P9.2 ; P6.7 32.73,9.04 ; P10.7 v1(21.73,9.5)
  Inner2 w0.15: v1(21.73,9.5) 21.87,9.64 32.13,9.64 v1(32.73,9.04) ; v1(21.73,9.5) 16.62,14.61 16.62,16.62 v1(17.56,17.56) ; v1(21.73,9.5) 21.73,8.43 20.14,6.83 17.97,6.83 v1(17.4,7.41)
  Bottom Layer w0.15: 34.07,46.48 33.65,46.48 33.4,46.23 33.4,42.4 29.5,38.5 22.84,38.5 17.78,43.56 17.78,51.56 16.89,52.45 13.72,52.45 13.08,51.82 10.4,51.82 H18.13
CORTEX_SWO_TDO: length 117.6
  Top Layer w0.15: 12.64,7.7 12.64,4.13 12,3.49 P9.6 ; 33.36,7.7 33.36,4.36 34,3.72 34,2.9 ; v1(15.74,17.66) 15.74,18.04 17.18,19.48 17.18,37.03 12.84,41.36 10.66,41.36 9.27,42.75 ; P10.2 25.54,2.55 25.69,2.7 28.23,2.7 29,3.48 v1(29,6.75)
  Bottom Layer w0.15: 9.27,42.75 10.49,41.53 15.11,41.53 19.14,37.5 30,37.5 34.66,42.16 34.66,43.91 34.66,43.91 34.66,46.1 34.66,46.1 34.66,46.22 34.92,46.48 35.34,46.48 ; v1(15.74,17.66) 16.62,16.78 16.62,12.85 12.58,8.81 12.58,7.77 13.86,6.48 25.27,6.48 26.29,7.5 28.26,7.5 v1(29,6.75) 32.41,6.75 33.36,7.7
  vias: v1(12.64,7.7) v1(33.36,7.7)
CORTEX_TDI: length 100.1
  Top Layer w0.15: v1(26.54,6.41) 26.54,4.45 26.18,4.08 24.65,4.08 24.27,3.7 P10.4 ; 10.8,2.9 10.7,3 10.7,3.59 11.37,4.26 11.37,7.7 ; 11.81,42.75 13.51,42.75 17.94,38.31 17.94,19.2 16.67,17.92 16.67,16.73 15.78,15.84 v1(15.7,15.84)
  Inner1 w0.15: v1(15.7,15.84) 15.7,13.16 11.37,8.83 v1(11.37,7.7) 14.02,5.05 25.18,5.05 v1(26.54,6.41) ; H17.2 17.59,42.74 19.81,44.96 19.81,49.02 22.5,51.71 33.03,51.71 P61.2
H_BOARD_ID_SCL: length 60
  Inner2 w0.15: P83.2 45,40.9 31.9,40.9 18.82,27.82 18.82,26.32 14.73,22.24 14.73,18.21 13.05,16.52 13.05,14.28 12.23,13.46 10.46,13.46 9.27,12.27
H_BOARD_ID_SDA: length 64.8
  Inner1 w0.15: 11.81,12.27 13.13,13.59 13.13,16.45 17.4,20.72 17.4,24.64 32.33,39.57 44.32,39.57 48.6,43.85 48.6,47.69 50.59,49.67 50.59,54.02 P82.2
H_WSTK_F5: length 31.5
  Inner2 w0.15: P64.2 33.28,50.7 28.01,50.7 26.44,49.12 22.71,49.12 19.56,45.97 19.56,44.32 15.43,40.2 H17.4 ; 11.81,40.21 11.85,40.21
H_WSTK_F6: length 87.5
  Top Layer w0.15: v1(34.05,8.58) 34.05,6 P6.5 ; 9.27,37.67 10.68,36.26 13.15,36.26 14.58,34.83 14.58,21.18 v1(15.45,20.31)
  Inner2 w0.15: v1(15.45,20.31) 17.32,20.31 19.23,18.4 19.23,14.68 21.87,12.04 32.58,12.04 34.05,10.57 v1(34.05,8.58)
  Bottom Layer w0.15: 9.27,37.67 10.49,36.45 14.05,36.45 15,35.5 31,35.5 37.2,41.7 37.2,43.91 37.2,43.91 37.2,46.1 37.2,46.1 37.2,46.22 37.46,46.48 37.88,46.48
H_WSTK_F7: length 86.3
  Top Layer w0.15: 35.2,2.9 35.2,3.79 34.63,4.36 v1(34.63,9.53) ; 11.81,37.67 11.89,37.59 13.25,37.59 15.49,35.35 15.49,22.03 v1(15.57,21.96)
  Inner1 w0.15: P63.2 34.19,50.34 27.78,50.34 26.56,49.11 22.7,49.11 21.34,47.75 21.34,44.2 14.8,37.66 H17.6
  Bottom Layer w0.15: v1(15.57,21.96) 19.17,18.36 19.17,14.61 23.22,10.56 33.61,10.56 v1(34.63,9.53)
H_WSTK_F8: length 38.4
  Bottom Layer w0.15: 9.27,35.13 10.49,33.91 21.1,33.91 21.69,34.5 31.5,34.5 38.5,41.5 38.5,46.25 38.73,46.48 39.15,46.48
H_WSTK_F9: length 35.5
  Inner2 w0.15: 11.81,35.13 12.33,35.13 23.56,46.36 23.56,46.92 24.63,48 26.64,48 28.27,49.63 34.75,49.63 P67.2
H_WSTK_F10: length 40.8
  Bottom Layer w0.15: 39.82,46.1 39.82,46.3 40,46.48 40.42,46.48 ; 9.27,32.59 10.49,31.37 21.57,31.37 23.7,33.5 32,33.5 39.82,41.32 ; 39.82,41.32 39.82,46.1
H_WSTK_F11: length 39
  Inner1 w0.15: P69.2 35.29,48.89 27.82,48.89 26.94,48.01 24.61,48.01 23.5,46.9 23.5,44.28 11.81,32.59
H_WSTK_F12: length 40.9
  Inner1 w0.15: P70.2 40.78,47.38 27.48,47.38 26.41,46.31 26.41,44.78 12.95,31.31 10.53,31.31 9.27,30.05
H_WSTK_F13: length 40.8
  Inner2 w0.15: 11.81,30.05 15.24,33.48 15.24,35.18 28.57,48.51 36.18,48.51 P71.2
H_WSTK_F14: length 43.5
  Inner2 w0.15: 9.27,27.51 10.59,28.83 12.6,28.83 28.3,44.53 28.3,46.6 29.08,47.38 42.05,47.38 P72.2
H_WSTK_F15: length 47
  Inner1 w0.15: P73.2 42.31,53.38 42.31,45.07 41.74,44.5 28.8,44.5 11.81,27.51
H_WSTK_F16: length 44.4
  Inner1 w0.15: 9.27,24.97 10.57,26.27 12.59,26.27 29.88,43.55 42.27,43.55 43.65,44.93 43.65,45.9 P74.2
H_WSTK_F17: length 50.2
  Inner2 w0.15: 11.81,24.97 14.5,27.66 14.5,29.36 29.87,44.73 43.03,44.73 43.6,45.3 43.6,53.4 P75.2
H_WSTK_F18: length 47.8
  Inner2 w0.15: 9.27,22.43 10.56,23.72 12.33,23.72 15.57,26.95 15.57,29.11 30.37,43.91 43.6,43.91 44.85,45.16 44.85,45.83 P76.2
H_WSTK_F19: length 87.3
  Top Layer w0.15: 11.81,22.43 14.12,20.12 14.12,17.75 13.61,17.24 13.61,16.08 v1(13.95,15.74) ; P10.9 20.6,6.09 20.6,8.66 20.23,9.03 ; P6.9 31.46,8.73
  Inner1 w0.15: v1(20.23,9.03) 20.53,8.73 v1(31.46,8.73) ; P77.2 44.85,53.38 44.85,44.71 42.78,42.64 30.75,42.64 13.2,25.09 13.2,24.28 11.81,22.88 11.81,22.43
  Inner2 w0.15: v1(20.23,9.03) 13.95,15.31 v1(13.95,15.74)
H_WSTK_F20: length 93.5
  Top Layer w0.15: v1(13.33,18.23) 12.84,18.72 10.44,18.72 9.27,19.89 ; v1(19.52,7.88) 19.22,7.58 19.22,4.08 20.4,2.9 ; 31.4,2.9 31.4,3.52 30.32,4.6 v1(30.32,7.73)
  Inner1 w0.15: 9.27,19.89 10.46,21.08 12.71,21.08 13.61,21.98 13.61,23.61 31.67,41.67 43.34,41.67 46.2,44.52 46.2,45.91 P78.2
  Bottom Layer w0.15: v1(30.32,7.73) 29.48,8.57 21.31,8.57 20.63,7.88 v1(19.52,7.88) 18.41,8.99 18.41,17.91 17.5,18.82 13.92,18.82 v1(13.33,18.23)
H_WSTK_F21: length 56.3
  Inner2 w0.15: 11.81,19.89 13.15,21.23 13.15,23.1 16.59,26.54 16.59,28.75 30.78,42.94 43.94,42.94 46.2,45.2 46.2,53.46 P79.2
H_WSTK_F22: length 54.2
  Inner1 w0.15: 9.73,17.35 9.73,17.53
  Inner2 w0.15: P80.2 47.37,45.81 47.37,44.87 44.46,41.96 31.32,41.96 17.65,28.3 17.65,26.43 13.86,22.64 13.86,20.04 12.49,18.67 10.59,18.67 9.27,17.35
H_WSTK_F23: length 58.6
  Inner1 w0.15: 11.81,17.35 11.81,17.81 14.68,20.68 14.68,23.31 32.02,40.65 43.85,40.65 47.39,44.19 47.39,53.38 P81.2
H_WSTK_P0: length 74.5
  Inner1 w0.15: H16.3 53.44,69.04 53.44,43.81 45.89,36.26 32.76,36.26 28.36,31.86 28.36,23.12 P5.2
H_WSTK_P1: length 70
  Inner2 w0.15: P13.2 28.36,30.67 28.36,32.36 32.83,36.83 46.62,36.83 54.74,44.95 54.74,70.48 58.8,74.55 61.49,74.55 H16.4
H_WSTK_P2: length 72.5
  Inner2 w0.15: P14.2 29.62,23.11 29.62,32.12 33.21,35.71 47.03,35.71 55.37,44.06 55.37,69.6 59.06,73.29 H16.5
H_WSTK_P3: length 67.2
  Inner1 w0.15: H16.6 61.49,72.01 58.29,72.01 54.41,68.13 54.41,42.59 46.91,35.09 33.09,35.09 29.62,31.62 29.62,30.66 P15.2
H_WSTK_P4: length 70
  Inner1 w0.15: P16.2 30.9,23.12 30.9,31.4 33.52,34.02 47.93,34.02 55.28,41.36 55.28,67.34 58.68,70.75 H16.7
H_WSTK_P5: length 66
  Inner2 w0.15: H16.8 61.57,71.95 59.37,71.95 56.01,68.58 56.01,43.16 47.49,34.65 33.65,34.65 31,32 31,30.77 P17.2
H_WSTK_P6: length 65.6
  Inner2 w0.15: P18.2 32.16,23.11 32.16,31.56 34.18,33.58 47.75,33.58 56.64,42.47 56.64,64.62 H16.9
H_WSTK_P7: length 63.8
  Inner1 w0.15: P19.2 32.2,30.7 32.2,31.2 33.9,32.9 48.85,32.9 56.14,40.19 56.14,66.43 59.18,69.47 61.51,69.47 H16.10
H_WSTK_P8: length 64.6
  Inner1 w0.15: P20.2 33.44,23.12 33.44,31.14 34.23,31.93 49.97,31.93 56.96,38.91 56.96,63.82 58.81,65.67 H16.11
H_WSTK_P9: length 57.1
  Inner2 w0.15: P21.2 33.5,30.73 33.5,31.5 34.61,32.61 48.01,32.61 57.28,41.88 57.28,62.18 59.61,64.52 61.62,64.52 H16.12
H_WSTK_P10: length 59.5
  Inner2 w0.15: H16.13 59.7,63.13 57.91,61.34 57.91,41.24 48.32,31.65 35.15,31.65 34.7,31.2 34.7,23.11 P22.2
H_WSTK_P11: length 56.6
  Inner1 w0.15: H16.14 61.62,61.98 59.31,61.98 57.78,60.44 57.78,37.64 49.16,29.02 35.07,29.02 P23.2
H_WSTK_P12: length 53.6
  Inner1 w0.15: P24.2 40.76,27.9 49.62,27.9 58.8,37.08 58.8,59.16 H16.15
H_WSTK_P13: length 54.9
  Inner2 w0.15: H16.16 61.51,61.85 59.69,61.85 58.55,60.71 58.55,40.5 50.29,32.24 50.29,29.95 49.65,29.31 36.05,29.31 P25.2
H_WSTK_P14: length 51.9
  Inner2 w0.15: P26.2 42.32,28.19 49.86,28.19 51.86,30.19 51.86,31.92 59.56,39.62 59.56,51.82 59.18,52.2 59.18,53.72 59.69,54.23 60.96,54.23 61.47,54.74 61.47,56.81 H16.17
H_WSTK_P15: length 47
  Bottom Layer w0.15: H16.18 61.51,59.31 58.29,59.31 54.86,55.88 54.86,44.83 50.63,40.6 44.09,40.6 37.22,33.72 37.22,30.79 36.61,30.18 36.61,30.08
H_WSTK_P16: length 48
  Inner1 w0.15: P28.2 42.18,26.78 50.14,26.78 60.2,36.83 60.2,50.55 61.47,51.82 61.47,54.27 H16.19
H_WSTK_P17: length 44.3
  Bottom Layer w0.15: 37.88,30.08 38.49,30.69 38.49,33.49 44.5,39.5 51.31,39.5 56.01,44.2 56.01,54.61 58.29,56.9 61.38,56.9 H16.20
H_WSTK_P18: length 43.2
  Inner2 w0.15: H16.21 60.32,52.87 60.32,37.07 50.17,26.92 43.59,26.92 P30.2
H_WSTK_P19: length 41.4
  Bottom Layer w0.15: H16.22 61.51,54.23 58.16,54.23 57.28,53.34 57.28,43.56 52.22,38.5 45,38.5 39.76,33.26 39.76,30.69 39.15,30.08
H_WSTK_P20: length 25.3
  Inner1 w0.15: 60.15,32.59 54.67,27.11 54.67,25.95 53.5,24.79 50.77,24.79 49.9,25.65 43.59,25.65 P32.2
H_WSTK_P21: length 28.8
  Bottom Layer w0.15: 62.69,32.59 61.25,34.04 57.15,34.04 53.68,37.5 45.5,37.5 41.03,33.03 41.03,30.74 40.42,30.13 40.42,30.08
H_WSTK_P22: length 22.2
  Inner2 w0.15: P34.2 44.91,25.7 50.13,25.7 50.89,24.94 53.36,24.94 58.47,30.05 60.15,30.05
H_WSTK_P23: length 27.6
  Bottom Layer w0.15: 41.69,30.08 41.69,30.18 42.3,30.79 42.3,32.8 46,36.5 52.78,36.5 57.91,31.37 61.38,31.37 62.69,30.05
H_WSTK_P24: length 20
  Inner1 w0.15: 60.15,27.51 56.25,23.61 50.48,23.61 49.57,24.53 45.01,24.53 P36.2
H_WSTK_P25: length 26.4
  Bottom Layer w0.15: 62.69,27.51 61.44,28.76 58.74,28.76 52,35.5 46.5,35.5 43.57,32.57 43.57,30.79 42.96,30.18 42.96,30.08
H_WSTK_P26: length 17
  Inner2 w0.15: 60.15,24.97 56.07,24.97 55.28,24.18 45.93,24.18 P38.2
H_WSTK_P27: length 25.2
  Bottom Layer w0.15: 44.23,30.08 44.23,30.13 44.84,30.74 44.84,32.34 47,34.5 51.22,34.5 59.46,26.27 61.4,26.27 62.69,24.97
H_WSTK_P28: length 17.3
  Inner1 w0.15: P40.2 46.43,23.41 49.31,23.41 49.92,22.8 49.92,21.98 51.1,20.81 56.62,20.81 58.24,22.43 60.15,22.43
H_WSTK_P29: length 24.5
  Bottom Layer w0.15: P41.2 45.5,30.13 46.1,30.73 46.1,31.7 47.9,33.5 51,33.5 58.92,25.58 58.92,24.39 59.54,23.77 60.74,23.77 62.07,22.43 62.69,22.43
H_WSTK_P30: length 15.2
  Inner2 w0.15: 60.15,19.89 56.33,19.89 52.87,23.36 47.65,23.36 P42.2
H_WSTK_P31: length 24.4
  Bottom Layer w0.15: P43.2 46.77,30.13 47.4,30.76 47.4,31.7 48.2,32.5 50.5,32.5 58.16,24.84 58.16,22.1 59.1,21.16 61.42,21.16 62.69,19.89
H_WSTK_P32: length 15.1
  Inner1 w0.15: P44.2 48.7,21.81 48.7,20.45 51.8,17.35 60.15,17.35 ; 48.04,22.37 48.09,22.42
H_WSTK_P33: length 23.5
  Bottom Layer w0.15: 62.69,17.35 61.43,18.62 59.62,18.62 57.27,20.96 57.27,24.38 50.08,31.57 49,31.57 48.65,31.21 48.65,30.79 48.04,30.18 48.04,30.08
H_WSTK_P34: length 15.5
  Inner2 w0.15: 60.15,14.81 54.4,14.81 50,19.21 50,21.78 P46.2
H_WSTK_P35: length 22.6
  Bottom Layer w0.15: 62.69,14.81 61.38,16.12 59.31,16.12 56.45,18.99 56.45,24.02 50.45,30.03 P47.2
H_WSTK_P36: length 36.4
  Bottom Layer w0.15: 27.72,46.48 27.3,46.48 27.1,46.28 27.1,43.74 26.67,43.31 24.26,43.31 21.59,45.98 21.59,52.96 19.43,55.12 19.43,57.66 12.7,64.39 10.52,64.39 H18.3 9.27,65.28
H_WSTK_P37: length 30
  Bottom Layer w0.15: P49.2 27.43,53.74 27.43,49.83 26.89,49.28 24.47,49.28 23.56,50.19 23.56,52.26 20.45,55.37 20.45,58.55 13.35,65.64 H18.4
H_WSTK_P38: length 36.5
  Bottom Layer w0.15: H18.5 10.52,61.85 13.33,61.85 18.41,56.77 18.41,55.12 20.83,52.7 20.83,45.47 23.79,42.5 27,42.5 28.31,43.81 28.31,43.91 28.31,43.91 28.31,46.22 28.57,46.48 28.99,46.48
H_WSTK_P39: length 22.1
  Inner2 w0.15: H18.6 20.17,54.74 23.99,54.74 24.89,55.64 28,55.64 28.37,55.27 28.37,54.64 P51.2
H_WSTK_P40: length 36.9
  Bottom Layer w0.15: H18.7 9.29,60.56 10.54,59.31 13.21,59.31 20.06,52.45 20.06,45.08 23.65,41.5 27.5,41.5 29.59,43.59 29.59,46.35 29.71,46.48 30.26,46.48
H_WSTK_P41: length 22.5
  Inner1 w0.15: P53.2 29.64,54.64 29.64,55.19 29.21,55.63 25.15,55.63 23.88,54.36 18.02,54.36 H18.8
H_WSTK_P42: length 38.3
  Bottom Layer w0.15: 31.53,46.48 31.11,46.48 30.9,46.27 30.9,43.4 28,40.5 23.38,40.5 19.3,44.58 19.3,52.07 14.6,56.77 10.16,56.77 9.27,57.66 H18.9
H_WSTK_P43: length 22.1
  Inner2 w0.15: P55.2 30.59,53.09 19.43,53.09 15.62,56.9 12.94,56.9 H18.10
H_WSTK_P44: length 39.3
  Bottom Layer w0.15: H18.11 10.65,54.1 16.25,54.1 18.54,51.82 18.54,44.2 23.24,39.5 28.5,39.5 32.13,43.13 32.13,46.28 32.33,46.48 32.8,46.48
H_WSTK_P45: length 22.5
  Inner1 w0.15: H18.12 14.49,55.48 17.09,52.89 31.66,52.89 P57.2
ISA3_#JRT: length 4.5
  Top Layer w0.15: 24.3,10.33 24.19,10.22 24.19,8.61 24.3,8.5 ; P10.3 24.19,6.03 24.19,8.42 24.27,8.5
WSTK_F1: length 7.5
  Bottom Layer w0.15: P1.14 34.07,51.89 34.68,52.5 34.68,54.31 P59.1
WSTK_F3: length 7.5
  Bottom Layer w0.15: P61.1 35.95,54.31 35.95,52.5 35.34,51.89 P1.16
WSTK_F5: length 7.5
  Bottom Layer w0.15: P64.1 37.22,54.31 37.22,52.5 36.61,51.89 P1.18
WSTK_F7: length 7.5
  Bottom Layer w0.15: P1.20 37.88,51.89 38.49,52.5 38.49,54.31 P63.1
WSTK_F9: length 7.5
  Bottom Layer w0.15: P1.22 39.15,51.89 39.76,52.5 39.76,54.31 P67.1
WSTK_F11: length 7.5
  Bottom Layer w0.15: P1.24 40.42,51.89 41.03,52.5 41.03,54.31 P69.1
WSTK_F13: length 7.5
  Bottom Layer w0.15: P1.26 41.69,51.89 42.3,52.5 42.3,54.31 P71.1
WSTK_F15: length 7.5
  Bottom Layer w0.15: P1.28 42.96,51.89 43.57,52.5 43.57,54.31 P73.1
WSTK_F17: length 7.5
  Bottom Layer w0.15: P75.1 44.84,54.31 44.84,52.5 44.23,51.89 P1.30
WSTK_F19: length 7.5
  Bottom Layer w0.15: P77.1 46.11,54.31 46.11,52.5 45.5,51.89 P1.32
WSTK_F21: length 7.5
  Bottom Layer w0.15: P1.34 46.77,51.89 47.38,52.5 47.38,54.31 P79.1
WSTK_F23: length 7.5
  Bottom Layer w0.15: P1.36 48.04,51.89 48.65,52.5 48.65,54.31 P81.1
WSTK_P1: length 7.5
  Bottom Layer w0.15: P13.1 27.1,30.31 27.1,28.5 27.72,27.89 P11.04
WSTK_P3: length 7.5
  Bottom Layer w0.15: P15.1 28.37,30.31 28.37,28.5 28.99,27.89 P11.06
WSTK_P5: length 7.5
  Bottom Layer w0.15: P11.08 30.26,27.89 29.64,28.5 29.64,30.31 P17.1
WSTK_P7: length 7.5
  Bottom Layer w0.15: P19.1 30.9,30.3 30.9,28.66 31.53,28.04 P11.10
WSTK_P9: length 7.5
  Bottom Layer w0.15: P11.12 32.8,27.89 32.18,28.5 32.18,30.31 P21.1
WSTK_P11: length 7.5
  Bottom Layer w0.15: P11.14 34.07,27.89 33.45,28.5 33.45,30.31 P23.1
WSTK_P13: length 7.5
  Bottom Layer w0.15: P25.1 34.72,30.31 34.72,28.5 35.34,27.89 P11.16
WSTK_P15: length 7.5
  Bottom Layer w0.15: P11.18 36.61,27.89 35.99,28.5 35.99,30.31 P27.1
WSTK_P17: length 7.5
  Bottom Layer w0.15: P11.20 37.88,27.89 37.26,28.5 37.26,30.23 37.88,30.84 P29.1
WSTK_P19: length 7.5
  Bottom Layer w0.15: P31.1 39.15,30.7 38.53,30.08 38.53,28.5 39.15,27.89 P11.22
WSTK_P21: length 7.5
  Bottom Layer w0.15: P11.24 40.42,27.89 39.8,28.5 39.8,30.18 40.42,30.79 P33.1
WSTK_P23: length 7.5
  Bottom Layer w0.15: P35.1 41.69,30.79 41.07,30.18 41.07,28.5 41.69,27.89 P11.26
WSTK_P25: length 7.5
  Bottom Layer w0.15: P11.28 42.96,27.89 42.34,28.5 42.34,30.23 42.96,30.84 P37.1
WSTK_P27: length 7.5
  Bottom Layer w0.15: P39.1 44.23,30.79 43.61,30.18 43.61,28.5 44.23,27.89 P11.30
WSTK_P29: length 7.5
  Bottom Layer w0.15: P11.32 45.5,27.89 44.88,28.5 44.88,30.18 45.5,30.79 P41.1
WSTK_P31: length 7.5
  Bottom Layer w0.15: P11.34 46.77,27.89 46.15,28.5 46.15,30.18 46.77,30.79 P43.1
WSTK_P33: length 7.5
  Bottom Layer w0.15: P11.36 48.04,27.89 47.42,28.5 47.42,30.18 48.04,30.79 P45.1
WSTK_P35: length 7.5
  Bottom Layer w0.15: P47.1 49.31,30.79 48.69,30.18 48.69,28.5 49.31,27.89 P11.38
WSTK_P37: length 7.5
  Bottom Layer w0.15: P1.04 27.72,48.52 28.33,49.13 28.33,54.31 P49.1
WSTK_P39: length 7.5
  Bottom Layer w0.15: P1.06 28.99,51.89 29.6,52.5 29.6,54.31 P51.1
WSTK_P41: length 7.5
  Bottom Layer w0.15: P1.08 30.26,51.89 30.87,52.5 30.87,54.31 P53.1
WSTK_P43: length 7.5
  Bottom Layer w0.15: P1.10 31.53,51.89 32.14,52.5 32.14,54.31 P55.1
WSTK_P45: length 7.5
  Bottom Layer w0.15: P57.1 33.41,54.31 33.41,52.5 32.8,51.89 P1.12
$2N1020: length 3.8
  Top Layer w0.15: 9.3,9.7 9.3,6.11 P9.9
$2N6156: length 3.5
  Top Layer w1.014: D1.2 57.27,9.94 56.71,9.38 ; 56.7,9.38 DC1.1

## Copper pours and planes (outline as drawn; the poured copper is in the pictures)
+3V3 on Top Layer: 23.85,17.42 25.47,17.42 25.47,15.7 23.85,15.7
+3V3 on Inner1: 23.85,17.42 25.73,17.42 25.73,15.27 23.85,15.27
GND on Top Layer: 34.03,18.16 36.45,18.16 36.45,15.37 34.03,15.37
GND on Top Layer: 50.22,24.85 51.79,24.85 51.79,19.2 50.22,19.2
GND on Top Layer: 26.82,53.17 26.82,55.14 26.59,55.37 24.97,55.37 24.61,55.02 24.61,53.17
GND on Top Layer: 36.96,14.6 39.62,14.6 39.62,9.78 36.96,9.78
GND on Top Layer: 48.94,50.85 48.94,55.73 49.1,55.88 50.06,55.88 50.06,54.15 49.66,53.75 49.66,51.26 49.25,50.85
GND on Top Layer: 45.08,13.33 47.88,13.33 47.88,9.65 45.08,9.65
GND on Top Layer: 26.82,20.48 26.82,25.52 24.4,25.52 24.4,20.48
GND on Bottom Layer: 23.26,48.91 26.81,48.91 26.81,46.91 23.77,46.91 23.26,47.43
GND on GND1: -1.53,82.04 78.61,82.04 78.61,-1.27 -1.53,-1.27
GND on GND2: -0.76,81.66 77.85,81.66 77.85,-1.4 -0.76,-1.4
+EXT_3V3 on Top Layer: 36.96,18.16 42.54,18.16 42.54,15.37 36.96,15.37
+EXT_5V on Top Layer: 44.96,18.03 50.67,18.03 50.67,14.35 44.96,14.35
+R_3V3 on Top Layer: 20.5,18.8 21.73,18.8 21.73,17.26 20.5,17.26
+R_3V3 on Inner2: 20.5,18.8 21.73,18.8 21.73,17.26 20.5,17.26
+R_5V on Top Layer: 20.22,12.28 22.33,12.28 22.33,10.92 20.22,10.92
+R_5V on Inner1: 20.22,12.28 22.33,12.28 22.33,10.92 20.22,10.92

## Text on the board
Bottom Silkscreen Layer: JLCJLCJLCJLC
Top Silkscreen Layer: EXP13 | P34 | P30 | GP0 | P32 | GP2 | P0 | EXP3 | P2 | EXP5 | P4 | EXP7 | P6 | EXP9 | P8 | EXP11 | P10 | P12 | SCL | P14 | P16 | P18 | P20 | P22 | P24 | P26 | P28 | GND | VRF-IN | VMCU / IN | MOSI | MISO | SDA | SCK | GP3 | P23 | P25 | P27 | P33 | P35 | P29 | GP1 | P13 | P15 | P17 | P21 | P31 | P19 | P11 | CS | P3 | P5 | P7 | RX | TX | P9 | P1 | I2C | PRO2 | SPI | UART | Cortex | 3V3 | P36 | P38 | P40 | P42 | D0 | P44 | D2 | F0 | SWDIO | F2 | RESET | BOARD_ID | 5V | SWO | F4 | F6 | Tx | F8 | CTS | F10 | LED0 | F12 | BUT0 | F14 | EN | F16 | SI | F18 | Inv | F20 | Data | F22 | P37 | Sens_EN | P39 | P41 | CLK | P43 | D1 | P45 | D3 | F1 | SWCLK | F3 | TDI | F5 | F7 | Rx | F9 | RTS | F11 | LED1 | F13 | BUT1 | F15 | F17 | SCS | F19 | FRAME | F21 | F23 | ISA3 | Mini / Simplicity | PTI | Disp | DBG Trace | VCom | VMCU_IN | WSTK | Ext | VRF_IN | VMCU | VRF | Breakout adapter for Radio Boards | OHPP-005C | 7-12VIN
